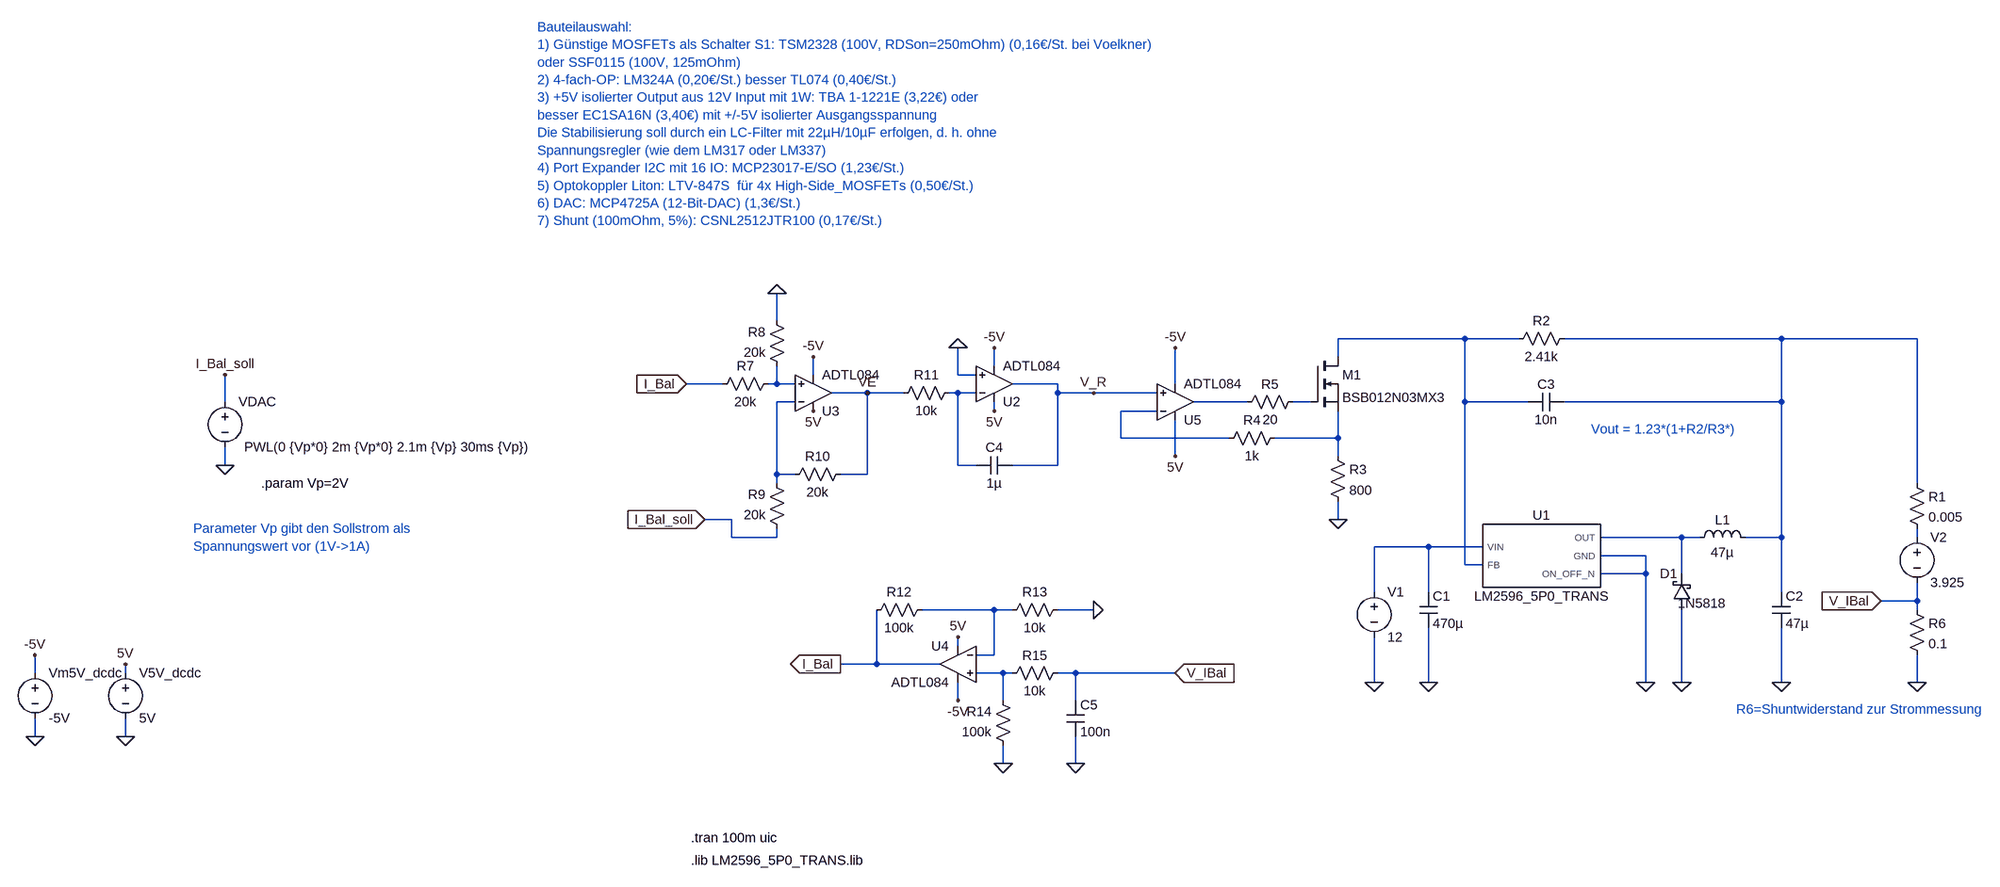
[diagram p0: schematic abgespecktes modell 04_07_26.asc]
abgespecktes modell 04_07_26.asc, the LTspice schematic file:
Version 4.1
SHEET 1 1992 1368
WIRE -1168 -272 -1168 -320
WIRE 48 -240 -176 -240
WIRE 144 -240 48 -240
WIRE 608 -240 224 -240
WIRE 848 -240 608 -240
WIRE -176 -208 -176 -240
WIRE -784 -192 -784 -224
WIRE -1104 -176 -1104 -208
WIRE -848 -176 -848 -224
WIRE -816 -176 -848 -176
WIRE -1264 -160 -1328 -160
WIRE -1168 -160 -1168 -192
WIRE -1168 -160 -1184 -160
WIRE -1136 -160 -1168 -160
WIRE -672 -160 -752 -160
WIRE -464 -160 -464 -224
WIRE -1008 -144 -1072 -144
WIRE -944 -144 -1008 -144
WIRE -848 -144 -864 -144
WIRE -816 -144 -848 -144
WIRE -672 -144 -672 -160
WIRE -608 -144 -672 -144
WIRE -496 -144 -608 -144
WIRE -2144 -128 -2144 -176
WIRE -1136 -128 -1168 -128
WIRE -336 -128 -432 -128
WIRE -224 -128 -256 -128
WIRE 48 -128 48 -240
WIRE 160 -128 48 -128
WIRE 608 -128 608 -240
WIRE 608 -128 224 -128
WIRE -784 -112 -784 -128
WIRE -496 -112 -560 -112
WIRE -560 -64 -560 -112
WIRE -368 -64 -560 -64
WIRE -176 -64 -176 -112
WIRE -176 -64 -288 -64
WIRE -464 -32 -464 -96
WIRE -176 -32 -176 -64
WIRE -2144 -16 -2144 -48
WIRE -848 -16 -848 -144
WIRE -816 -16 -848 -16
WIRE -672 -16 -672 -144
WIRE -672 -16 -752 -16
WIRE -1168 0 -1168 -128
WIRE -1136 0 -1168 0
WIRE -1008 0 -1008 -144
WIRE -1008 0 -1056 0
WIRE -1168 16 -1168 0
WIRE 848 16 848 -240
WIRE -1248 80 -1296 80
WIRE -176 80 -176 48
WIRE -1248 112 -1248 80
WIRE -1168 112 -1168 96
WIRE -1168 112 -1248 112
WIRE 432 112 288 112
WIRE 464 112 432 112
WIRE 608 112 608 -128
WIRE 608 112 544 112
WIRE 848 112 848 96
WIRE -16 128 -112 128
WIRE 80 128 -16 128
WIRE 368 144 288 144
WIRE 48 160 48 -128
WIRE 80 160 48 160
WIRE 368 176 368 144
WIRE 368 176 288 176
WIRE 432 176 432 112
WIRE -112 208 -112 128
WIRE -16 208 -16 128
WIRE 608 208 608 112
WIRE 848 224 848 192
WIRE 848 224 784 224
WIRE -784 240 -912 240
WIRE -752 240 -784 240
WIRE -608 240 -672 240
WIRE 848 240 848 224
WIRE -848 304 -848 288
WIRE -784 320 -784 240
WIRE -784 320 -816 320
WIRE -992 336 -992 240
WIRE -992 336 -1056 336
WIRE -880 336 -992 336
WIRE -2480 352 -2480 320
WIRE -2320 352 -2320 336
WIRE -768 352 -816 352
WIRE -752 352 -768 352
WIRE -640 352 -672 352
WIRE -464 352 -640 352
WIRE -112 368 -112 288
WIRE -16 368 -16 272
WIRE 368 368 368 176
WIRE 432 368 432 240
WIRE 608 368 608 272
WIRE 848 368 848 320
WIRE -848 400 -848 368
WIRE -768 400 -768 352
WIRE -640 400 -640 352
WIRE -2480 464 -2480 432
WIRE -2320 464 -2320 432
WIRE -768 512 -768 480
WIRE -640 512 -640 464
FLAG -112 368 0
FLAG -16 368 0
FLAG 368 368 0
FLAG 608 368 0
FLAG 848 368 0
FLAG -176 80 0
FLAG 432 368 0
FLAG -2144 -16 0
FLAG -2320 464 0
FLAG -2144 -176 I_Bal_soll
FLAG -2320 336 5V
FLAG -464 -32 5V
FLAG -1168 -320 0
FLAG -1328 -160 I_Bal
IOPIN -1328 -160 In
FLAG -1104 -112 5V
FLAG -2480 464 0
FLAG -2480 320 -5V
FLAG -1104 -208 -5V
FLAG -784 -112 5V
FLAG -784 -224 -5V
FLAG -1296 80 I_Bal_soll
IOPIN -1296 80 In
FLAG -1008 -144 VE
FLAG -608 -144 V_R
FLAG -848 -224 0
FLAG -464 -224 -5V
FLAG -848 288 5V
FLAG -848 400 -5V
FLAG -640 512 0
FLAG -464 352 V_IBal
IOPIN -464 352 In
FLAG -1056 336 I_Bal
IOPIN -1056 336 Out
FLAG 784 224 V_IBal
IOPIN 784 224 In
FLAG -768 512 0
FLAG -608 240 0
SYMBOL voltage -112 192 R0
WINDOW 123 0 0 Left 0
WINDOW 39 0 0 Left 0
SYMATTR InstName V1
SYMATTR Value 12
SYMBOL cap -32 208 R0
SYMATTR InstName C1
SYMATTR Value 470µ
SYMBOL ind 448 128 R270
WINDOW 0 32 56 VTop 2
WINDOW 3 5 56 VBottom 2
SYMATTR InstName L1
SYMATTR Value 47µ
SYMATTR SpiceLine Rser=1m
SYMBOL cap 592 208 R0
SYMATTR InstName C2
SYMATTR Value 47µ
SYMBOL res 832 0 R0
SYMATTR InstName R1
SYMATTR Value 0.005
SYMBOL res 240 -256 R90
WINDOW 0 0 56 VBottom 2
WINDOW 3 32 56 VTop 2
SYMATTR InstName R2
SYMATTR Value 2.41k
SYMBOL res -192 -48 R0
SYMATTR InstName R3
SYMATTR Value 800
SYMBOL schottky 448 240 R180
WINDOW 0 24 64 Left 2
WINDOW 3 -62 12 Left 2
SYMATTR InstName D1
SYMATTR Value 1N5818
SYMATTR Description Diode
SYMATTR Type diode
SYMBOL voltage 848 96 R0
WINDOW 123 0 0 Left 0
WINDOW 39 0 0 Left 0
SYMATTR InstName V2
SYMATTR Value 3.925
SYMBOL LM2596_5P0_TRANS 176 144 R0
SYMATTR InstName U1
SYMBOL nmos -224 -208 R0
SYMATTR InstName M1
SYMATTR Value BSB012N03MX3
SYMBOL voltage -2144 -144 R0
WINDOW 3 34 96 Left 2
WINDOW 123 0 0 Left 0
WINDOW 39 0 0 Left 0
SYMATTR Value PWL(0 {Vp*0} 2m {Vp*0} 2.1m {Vp} 30ms {Vp})
SYMATTR InstName VDAC
SYMBOL voltage -2320 336 R0
WINDOW 123 0 0 Left 0
WINDOW 39 0 0 Left 0
SYMATTR InstName V5V_dcdc
SYMATTR Value 5V
SYMBOL res -384 -48 R270
WINDOW 0 32 56 VTop 2
WINDOW 3 0 56 VBottom 2
SYMATTR InstName R4
SYMATTR Value 1k
SYMBOL res -240 -144 R90
WINDOW 0 0 56 VBottom 2
WINDOW 3 32 56 VTop 2
SYMATTR InstName R5
SYMATTR Value 20
SYMBOL cap 224 -144 R90
WINDOW 0 0 32 VBottom 2
WINDOW 3 32 32 VTop 2
SYMATTR InstName C3
SYMATTR Value 10n
SYMBOL res 832 224 R0
SYMATTR InstName R6
SYMATTR Value 0.1
SYMBOL res -1168 -176 R90
WINDOW 0 0 56 VBottom 2
WINDOW 3 32 56 VTop 2
SYMATTR InstName R7
SYMATTR Value 20k
SYMBOL res -1152 -176 R180
WINDOW 0 36 76 Left 2
WINDOW 3 36 40 Left 2
SYMATTR InstName R8
SYMATTR Value 20k
SYMBOL res -1152 112 R180
WINDOW 0 36 76 Left 2
WINDOW 3 36 40 Left 2
SYMATTR InstName R9
SYMATTR Value 20k
SYMBOL res -1152 16 R270
WINDOW 0 32 56 VTop 2
WINDOW 3 0 56 VBottom 2
SYMATTR InstName R10
SYMATTR Value 20k
SYMBOL voltage -2480 336 R0
WINDOW 123 0 0 Left 0
WINDOW 39 0 0 Left 0
SYMATTR InstName Vm5V_dcdc
SYMATTR Value -5V
SYMBOL cap -752 -32 R90
WINDOW 0 0 32 VBottom 2
WINDOW 3 32 32 VTop 2
SYMATTR InstName C4
SYMATTR Value 1µ
SYMBOL res -848 -160 R90
WINDOW 0 0 56 VBottom 2
WINDOW 3 32 56 VTop 2
SYMATTR InstName R11
SYMATTR Value 10k
SYMBOL OpAmps\\ADTL084 -464 -64 M180
SYMATTR InstName U5
SYMBOL OpAmps\\ADTL084 -784 -96 M180
SYMATTR InstName U2
SYMBOL OpAmps\\ADTL084 -1104 -80 M180
SYMATTR InstName U3
SYMBOL OpAmps\\ADTL084 -848 272 M0
SYMATTR InstName U4
SYMBOL res -752 496 R180
WINDOW 0 36 76 Left 2
WINDOW 3 36 40 Left 2
SYMATTR InstName R14
SYMATTR Value 100k
SYMBOL res -768 368 R270
WINDOW 0 32 56 VTop 2
WINDOW 3 0 56 VBottom 2
SYMATTR InstName R15
SYMATTR Value 10k
SYMBOL cap -656 400 R0
SYMATTR InstName C5
SYMATTR Value 100n
SYMBOL res -1008 256 R270
WINDOW 0 32 56 VTop 2
WINDOW 3 0 56 VBottom 2
SYMATTR InstName R12
SYMATTR Value 100k
SYMBOL res -656 224 R90
WINDOW 0 0 56 VBottom 2
WINDOW 3 32 56 VTop 2
SYMATTR InstName R13
SYMATTR Value 10k
TEXT -1320 760 Left 2 !.lib LM2596_5P0_TRANS.lib
TEXT -1320 720 Left 2 !.tran 100m uic
TEXT 272 -80 Left 2 ;Vout = 1.23*(1+R2/R3*)
TEXT -2080 16 Left 2 !.param Vp=2V
TEXT -1592 -792 Left 2 ;Bauteilauswahl:\n1) Günstige MOSFETs als Schalter S1: TSM2328 (100V, RDSon=250mOhm) (0,16€/St. bei Voelkner)\noder SSF0115 (100V, 125mOhm)\n2) 4-fach-OP: LM324A (0,20€/St.) besser TL074 (0,40€/St.)\n3) +5V isolierter Output aus 12V Input mit 1W: TBA 1-1221E (3,22€) oder \nbesser EC1SA16N (3,40€) mit +/-5V isolierter Ausgangsspannung\nDie Stabilisierung soll durch ein LC-Filter mit 22µH/10µF erfolgen, d. h. ohne \nSpannungsregler (wie dem LM317 oder LM337) \n4) Port Expander I2C mit 16 IO: MCP23017-E/SO (1,23€/St.)\n5) Optokoppler Liton: LTV-847S  für 4x High-Side_MOSFETs (0,50€/St.)\n6) DAC: MCP4725A (12-Bit-DAC) (1,3€/St.)\n7) Shunt (100mOhm, 5%): CSNL2512JTR100 (0,17€/St.)
TEXT -2200 96 Left 2 ;Parameter Vp gibt den Sollstrom als \nSpannungswert vor (1V->1A)
TEXT 528 416 Left 2 ;R6=Shuntwiderstand zur Strommessung

The netlist it stands for:
* abgespecktes modell 04_07_26.asc
V1 N012 0 12
C1 N012 0 470µ
L1 N010 N002 47µ Rser=1m
C2 N002 0 47µ
R1 N002 N011 0.005
R2 N002 N001 2.41k
R3 N009 0 800
D1 0 N010 1N5818
V2 N011 V_IBal 3.925
X§U1 N012 N001 N010 0 0 LM2596_5P0_TRANS  ; pins VIN FB OUT GND ON_OFF_N
M1 N001 N007 N009 N009 BSB012N03MX3
VDAC I_Bal_soll 0 PWL(0 {Vp*0} 2m {Vp*0} 2.1m {Vp} 30ms {Vp})
V5V_dcdc 5V 0 5V
R4 N008 N009 1k
R5 N007 N006 20
C3 N002 N001 10n
R6 V_IBal 0 0.1
R7 N003 I_Bal 20k
R8 N003 0 20k
R9 I_Bal_soll N005 20k
R10 N005 VE 20k
Vm5V_dcdc -5V 0 -5V
C4 V_R N004 1µ
R11 N004 VE 10k
X§U5 V_R N008 5V -5V N006 ADTL084  ; pins In+ In- V+ V- OUT
X§U2 0 N004 5V -5V V_R ADTL084  ; pins In+ In- V+ V- OUT
X§U3 N003 N005 5V -5V VE ADTL084  ; pins In+ In- V+ V- OUT
X§U4 N014 N013 5V -5V I_Bal ADTL084  ; pins In+ In- V+ V- OUT
R14 0 N014 100k
R15 N014 V_IBal 10k
C5 V_IBal 0 100n
R12 I_Bal N013 100k
R13 0 N013 10k
.model D D
.lib standard.dio
.model NMOS NMOS
.model PMOS PMOS
.lib standard.mos
.lib LM2596_5P0_TRANS.lib
.tran 100m uic
* Vout = 1.23*(1+R2/R3*)
.param Vp=2V
* Bauteilauswahl:
* 1) Günstige MOSFETs als Schalter S1: TSM2328 (100V, RDSon=250mOhm) (0,16€/St. bei Voelkner)
* oder SSF0115 (100V, 125mOhm)
* 2) 4-fach-OP: LM324A (0,20€/St.) besser TL074 (0,40€/St.)
* 3) +5V isolierter Output aus 12V Input mit 1W: TBA 1-1221E (3,22€) oder
* besser EC1SA16N (3,40€) mit +/-5V isolierter Ausgangsspannung
* Die Stabilisierung soll durch ein LC-Filter mit 22µH/10µF erfolgen, d. h. ohne
* Spannungsregler (wie dem LM317 oder LM337)
* 4) Port Expander I2C mit 16 IO: MCP23017-E/SO (1,23€/St.)
* 5) Optokoppler Liton: LTV-847S  für 4x High-Side_MOSFETs (0,50€/St.)
* 6) DAC: MCP4725A (12-Bit-DAC) (1,3€/St.)
* 7) Shunt (100mOhm, 5%): CSNL2512JTR100 (0,17€/St.)
* Parameter Vp gibt den Sollstrom als
* Spannungswert vor (1V->1A)
* R6=Shuntwiderstand zur Strommessung
.lib ADTL084.lib
.backanno
.end